# EAGLE design RTC Amiga kulamario@yahoo.ie (EAGLE 7.5.0)
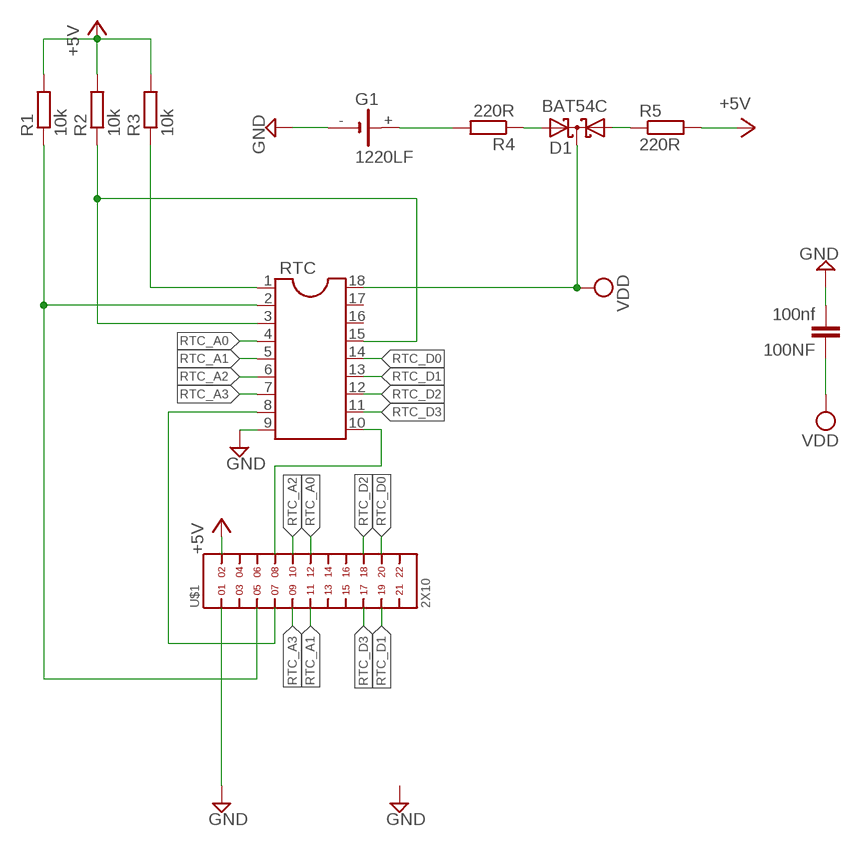
[diagram p0: schematic, sheet 1]

## Parts
100NF  100nf  C-EUC0603  [C0603]
D1  BAT54C  [SOT23]
G1  1220LF  CH291-1220LF  [CH291-1220LF]
R1  10k  R-EU_R0603  [R0603]
R2  10k  R-EU_R0603  [R0603]
R3  10k  R-EU_R0603  [R0603]
R4  220R  R-EU_R0603  [R0603]
R5  220R  R-EU_R0603  [R0603]
RTC  DIL18  [DIL18]
U$1  2X10  [2X10]

## Nets
+5V: R1.2 R2.2 R3.2 R5.2 U$1.2
GND: 100NF.2 G1.- RTC.9 U$1.1
N$1: D1.1(A1) R5.1
N$2: D1.2(A2) R4.1
N$4: R3.1 RTC.1
N$6: R1.1 RTC.2 U$1.5
N$7: RTC.8 U$1.7
N$11: RTC.10 U$1.8
N$17: R2.1 RTC.3 RTC.15
N$19: G1.+ R4.2
RTC_A0: RTC.4 U$1.12
RTC_A1: RTC.5 U$1.11
RTC_A2: RTC.6 U$1.10
RTC_A3: RTC.7 U$1.9
RTC_D0: RTC.14 U$1.20
RTC_D1: RTC.13 U$1.19
RTC_D2: RTC.12 U$1.18
RTC_D3: RTC.11 U$1.17
VDD: 100NF.1 D1.3(CC) RTC.18
Unconnected: RTC.16 RTC.17 U$1.3 U$1.4 U$1.6 U$1.13 U$1.14 U$1.15 U$1.16 U$1.21 U$1.22

## Library data of the parts
100NF = rcl:C-EU: CAPACITOR, European symbol
D1 = diode:BAT54C: Schottky Diodes Source: Fairchild .. BAT54.pdf
G1 = battery:CH291-1220LF: Battery Holder, SMT, 12mm multicomp PART NO. CH291-1220LF Source: Data sheet <http://www.farnell.com/datasheets/1505860.pdf>
R1-R5 = rcl:R-EU_: RESISTOR, European symbol
RTC = ic-package:DIL18: Dual In Line / Socket
U$1 = 11pin_header_2mm:2X10

## Board
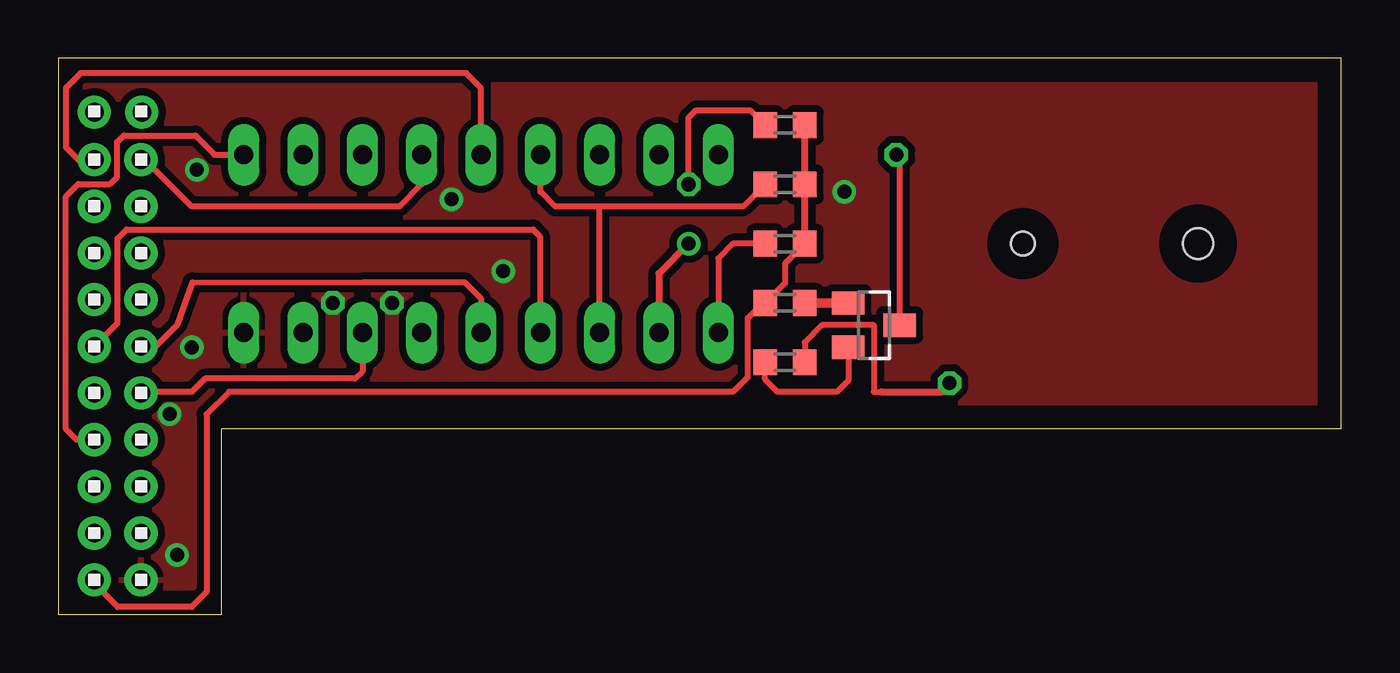
[diagram p1: board, top side]
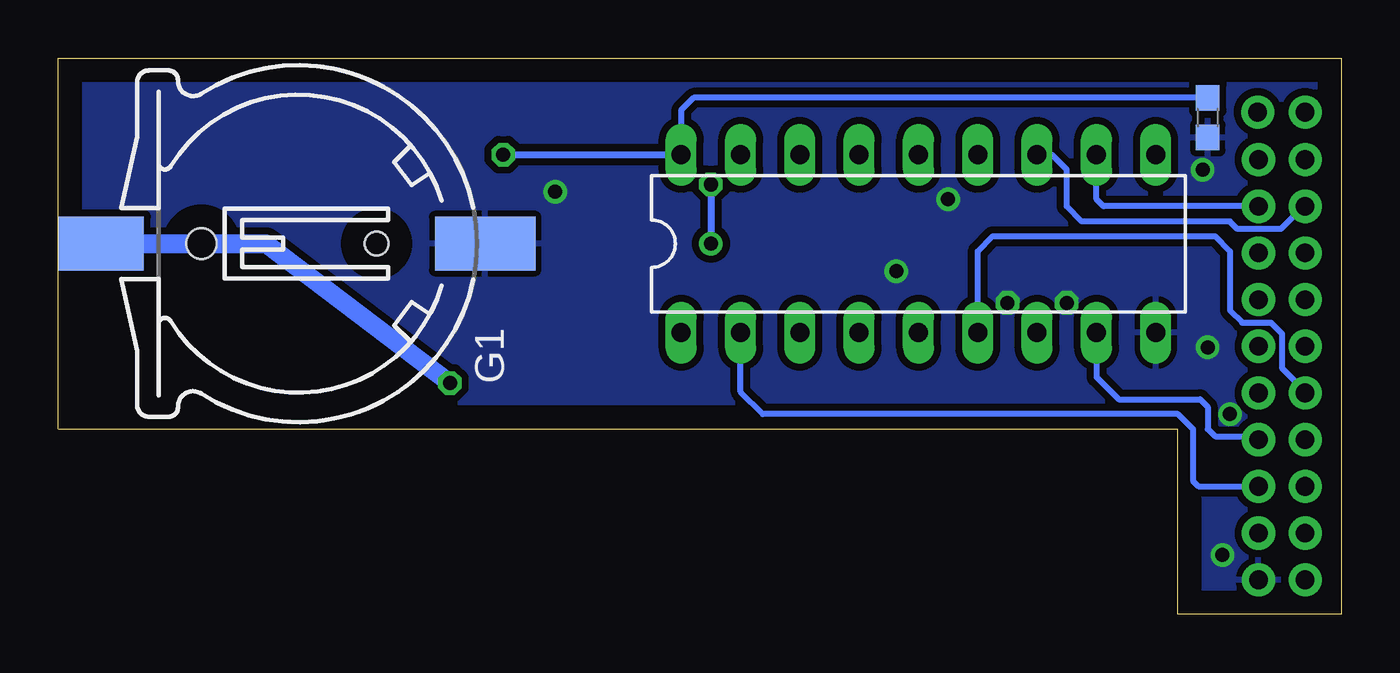
[diagram p2: board, bottom side, seen from below]

Size 54.93 x 23.81 mm. Coordinates in mm from the lower left corner, seen from the top.
Outline: 54.93,7.94 54.93,23.81 0,23.81 0,0 6.99,0 6.99,7.94 54.93,7.94
Copper layers (1*16): Top 0.035mm / dielectric 1.5mm / Bottom 0.035mm
Design rules "default": minimum track width 10mil, minimum drill 24mil, track to track 8mil, track to pad 8mil, pad to pad 8mil, via to via 8mil, smd to smd 8mil, copper to edge 40mil, drill to drill 8mil, minimum pad ring 10mil, minimum via ring 8mil, stop-mask expansion 4mil, vias tented up to drill 0mil, thermal gap 10mil

### Footprints (pad centres in the part's own frame; a part is rotated, then mirrored left to right if it is on the bottom)
C0603 = smd 1.1 x 1: 1 -0.85,0; 2 0.85,0
SOT23 = smd 1 x 1.4: 1 -0.95,-1.1; 2 0.95,-1.1; 3 0,1.1
CH291-1220LF = smd 2.3 x 3.66: + 0,-2.296 | smd 2.3 x 4.3: - 0,14.146 | hole 1.3: 0,2 | hole 1: 0,9.5
R0603 = smd 1 x 1.1: 1 -0.85,0; 2 0.85,0
DIL18 = drill 0.813 long: 1 -10.16,-3.81; 2 -7.62,-3.81; 3 -5.08,-3.81; 4 -2.54,-3.81; 5 0,-3.81; 6 2.54,-3.81; 7 5.08,-3.81; 8 7.62,-3.81; 9 10.16,-3.81; 10 10.16,3.81; 11 7.62,3.81; 12 5.08,3.81; 13 2.54,3.81; 14 0,3.81; 15 -2.54,3.81; 16 -5.08,3.81; 17 -7.62,3.81; 18 -10.16,3.81
2X10 = drill 0.8 pad 1.422: 1 -9,-1; 2 -9,1; 3 -7,-1; 4 -7,1; 5 -5,-1; 6 -5,1; 7 -3,-1; 8 -3,1; 9 -1,-1; 10 -1,1; 11 1,-1; 12 1,1; 13 3,-1; 14 3,1; 15 5,-1; 16 5,1; 17 7,-1; 18 7,1; 19 9,-1; 20 9,1; 21 11.032,1; 22 11.032,-1.032

### Placement (x,y rotation side)
100NF  5.71,21.27 270 bottom
D1  34.92,12.38 270 top
G1  50.8,15.88 270 bottom
R1  31.11,20.95 0 top
R2  31.11,18.41 0 top
R3  31.11,15.88 0 top
R4  31.11,10.79 0 top
R5  31.11,13.34 180 top
RTC  18.1,15.88 0 bottom
U$1  2.54,10.48 90 top

### Tracks (layer width: path | path; a pad name or v marks a point on that pad's centre or on a via)
+5V
  Top 0.254: U$1.2 1.54,1.32 2.54,0.32 5.71,0.32 6.35,0.95 6.35,8.57 7.3,9.53 28.89,9.53 29.53,10.16 29.53,12.7 30.16,13.34 R5.2 31.11,14.19 31.11,15.03 R3.2
  Top 0.305: R3.2 R2.2 R1.2
GND  (via drill 0.6 pad 0.25)
  Bottom 0.305: 100NF.2 5.62,20.52
  other vias: 5.08,2.54 5.93,19.04 14.29,13.34 11.75,13.34 16.83,17.78 19.04,14.69 33.66,18.1 4.76,8.57 5.71,11.43
  pour Bottom (isolate 0.305): 0,0 0,23.81 54.93,23.81 54.93,7.94 6.99,7.94 6.99,0
  pour Top (isolate 0.305): 0,0 0,23.81 54.93,23.81 54.93,7.94 6.99,7.94 6.99,0
N$1
  Top 0.406: D1.1 34.14,13.34 R5.1
N$2
  Top 0.254: D1.2 33.83,10.01 33.34,9.53 30.8,9.53 30.27,10.06 R4.1
N$4
  Top 0.254: R3.1 28.89,15.88 28.26,15.24 RTC.1
N$6  (via drill 0.6 pad 0.25)
  Top 0.254: v26.99,18.41 26.99,21.27 27.3,21.59 29.63,21.59 R1.1
  Top 0.305: v26.99,15.88 25.72,14.61 RTC.2
  Bottom 0.254: U$1.5 6.11,5.48 6.35,5.71 6.35,7.94 6.99,8.57 24.77,8.57 25.72,9.53 RTC.2
  Bottom 0.305: v26.99,18.41 v26.99,15.88
N$7
  Bottom 0.254: U$1.7 3.68,7.62 5.4,7.62 5.71,7.94 5.71,8.89 6.03,9.21 9.53,9.21 10.48,10.16 RTC.8
N$11
  Top 0.254: U$1.8 0.78,7.48 0.32,7.94 0.32,17.89 0.86,18.43 2.22,18.43 2.52,18.73 2.52,20.23 2.8,20.51 5.87,20.51 6.69,19.68 RTC.10
N$17
  Top 0.254: 23.18,17.46 29.31,17.46 R2.1 | RTC.3 23.18,17.46 | 23.18,17.46 21.27,17.46 20.64,18.1 RTC.15
N$19  (via drill 0.6)
  Top 0.254: 31.97,10.8 R4.2 31.96,11.64 32.7,12.38 34.91,12.38 34.91,12.39 34.91,9.53 35.24,9.53
  Top 0.305: 35.24,9.53 37.78,9.53 arc90 v38.16,9.9
  Bottom 0.813: G1.+ 46.04,15.88 v38.16,9.9
RTC_A0
  Top 0.254: U$1.12 2.54,12.48 2.54,16.1 2.92,16.48 20.33,16.48 20.62,16.19 20.62,12.08 RTC.4
RTC_A1
  Top 0.254: U$1.11 4.17,11.48 5.11,12.41 5.74,14.22 13.05,14.22 17.4,14.22 18.1,13.53 RTC.5
RTC_A2
  Bottom 0.254: RTC.6 15.56,15.56 14.92,16.19 5.4,16.19 4.76,15.56 4.76,13.02 4.23,12.49 3.01,12.49 2.54,12.02 2.54,10.55 1.54,9.55 U$1.10
RTC_A3
  Top 0.254: RTC.7 13.02,10.41 12.7,10.09 6.28,10.09 5.71,9.53 3.59,9.53 U$1.9
RTC_D0
  Top 0.254: RTC.14 18.1,22.54 17.46,23.18 0.95,23.18 0.32,22.54 0.32,20 0.95,19.37 1.43,19.37 U$1.20
RTC_D1
  Top 0.254: RTC.13 15.56,18.41 14.61,17.46 5.71,17.46 3.7,19.48 U$1.19
RTC_D2
  Bottom 0.254: U$1.18 1.61,17.48 2.58,16.51 4.45,16.51 4.76,16.83 11.11,16.83 11.75,17.46 11.75,19.05 12.38,19.68 RTC.12
RTC_D3
  Bottom 0.254: U$1.17 10.18,17.48 10.48,17.78 RTC.11
VDD  (via drill 0.6 pad 0.25)
  Top 0.254: D1.3 36.02,19.54 v35.88,19.68
  Bottom 0.254: 100NF.1 27.73,22.12 28.26,21.59 RTC.18
  Bottom 0.305: v35.88,19.68 RTC.18

### Text on the board
tValues: kulamario@yahoo.ie | 8/10/2019 | Amiga 1200 RTC Module